# EAGLE design power-supply (EAGLE 9.6.2)
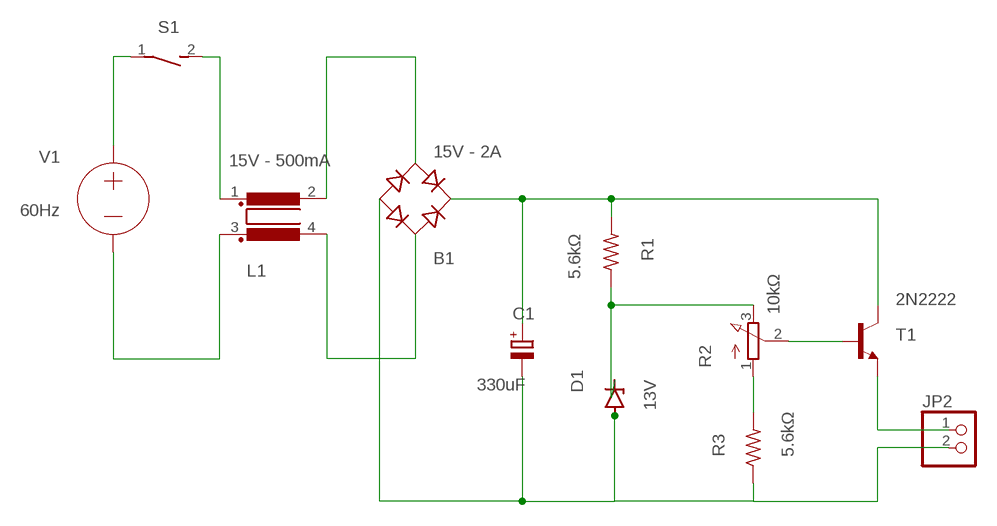
[diagram p0: schematic, sheet 1]

## Parts
B1  15V - 2A  RB1A  [RB1A]
C1  330uF  CPOL-EUE3.5-10  [E3,5-10]
D1  13V  ZENER-DIODEDO41Z10  [DO41Z10]
JP2  PINHD-1X2  [1X02]
L1  15V - 500mA  R1405VB2  [B2]
R1  5.6kΩ  R-US_0309/12  [0309/12]
R2  10kΩ  3RP/1610N  [3RP/1610N]
R3  5.6kΩ  R-US_0309/12  [0309/12]
S1  DS01E  [DS-01]
T1  2N2222  [TO18]
V1  60Hz  VOLTAGE  (no package)

## Nets
N$1: R2.1(A) R3.2
N$2: S1.1 V1.+
N$4: B1.AC2 L1.2
N$5: B1.AC1 L1.4
N$6: D1.C R1.1 R2.3(E)
N$7: B1.+ C1.+ R1.2 T1.3(C)
N$8: B1.- C1.- D1.A JP2.2 R3.1
N$9: JP2.1 T1.1(E)
N$11: L1.1 S1.2
N$12: R2.2(S) T1.2(B)
N$13: L1.3 V1.-

## Library data of the parts
B1 = rectifier:RB1A: RECTIFIER 1 A
C1 = rcl:CPOL-EU: POLARIZED CAPACITOR, European symbol; SPICEPREFIX: C
D1 = diode:ZENER-DIODE: Z-Diode
JP2 = pinhead:PINHD-1X2: PIN HEADER
L1 = inductor-nkl:R1405V: Übertrager (verlustarm) bis typ. 400kHz Power transformer (low loss) up to typ. 400kHz; OC_FARNELL: unknown; OC_NEWARK: unknown
R1 R3 = rcl:R-US_: RESISTOR, American symbol; SPICEPREFIX: R
R2 = pot:3RP/1610N: 16mm Potentiometer one level Source: http://www.alphapotentiometers.net/html/16mm_pot_2.html
S1 = switch-dil:DS01E: DIL/CODE SWITCH; OC_FARNELL: unknown; OC_NEWARK: unknown
T1 = transistor-neu-to92:2N2222: NPN TRANSISTOR
V1 = ngspice-simulation:VOLTAGE: Independent Voltage Source, either DC, AC, PULSE, SINE, PWL, EXP, or SFFM; VALUE: 0V

## Board
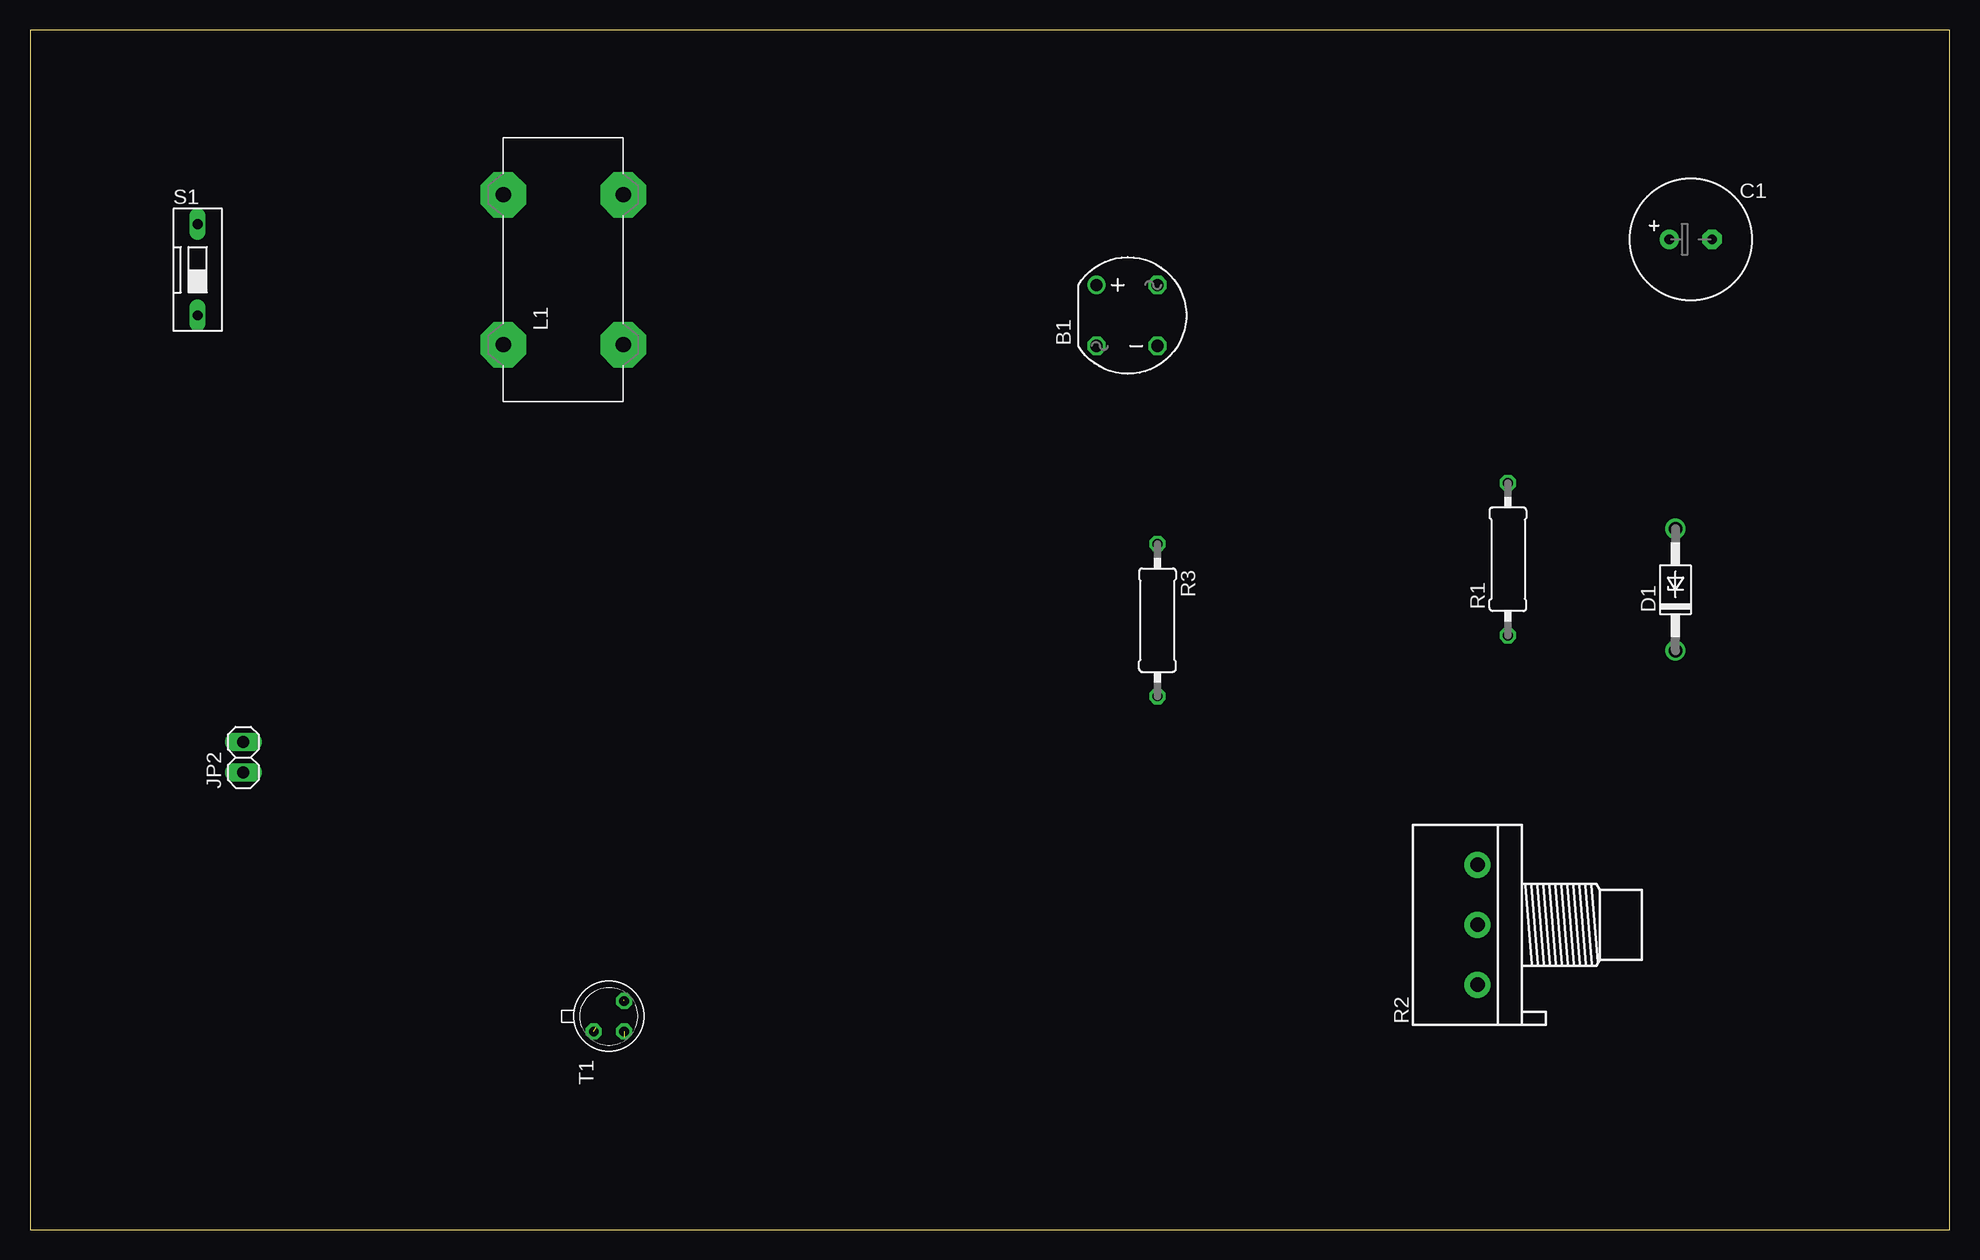
[diagram p1: board, top side]
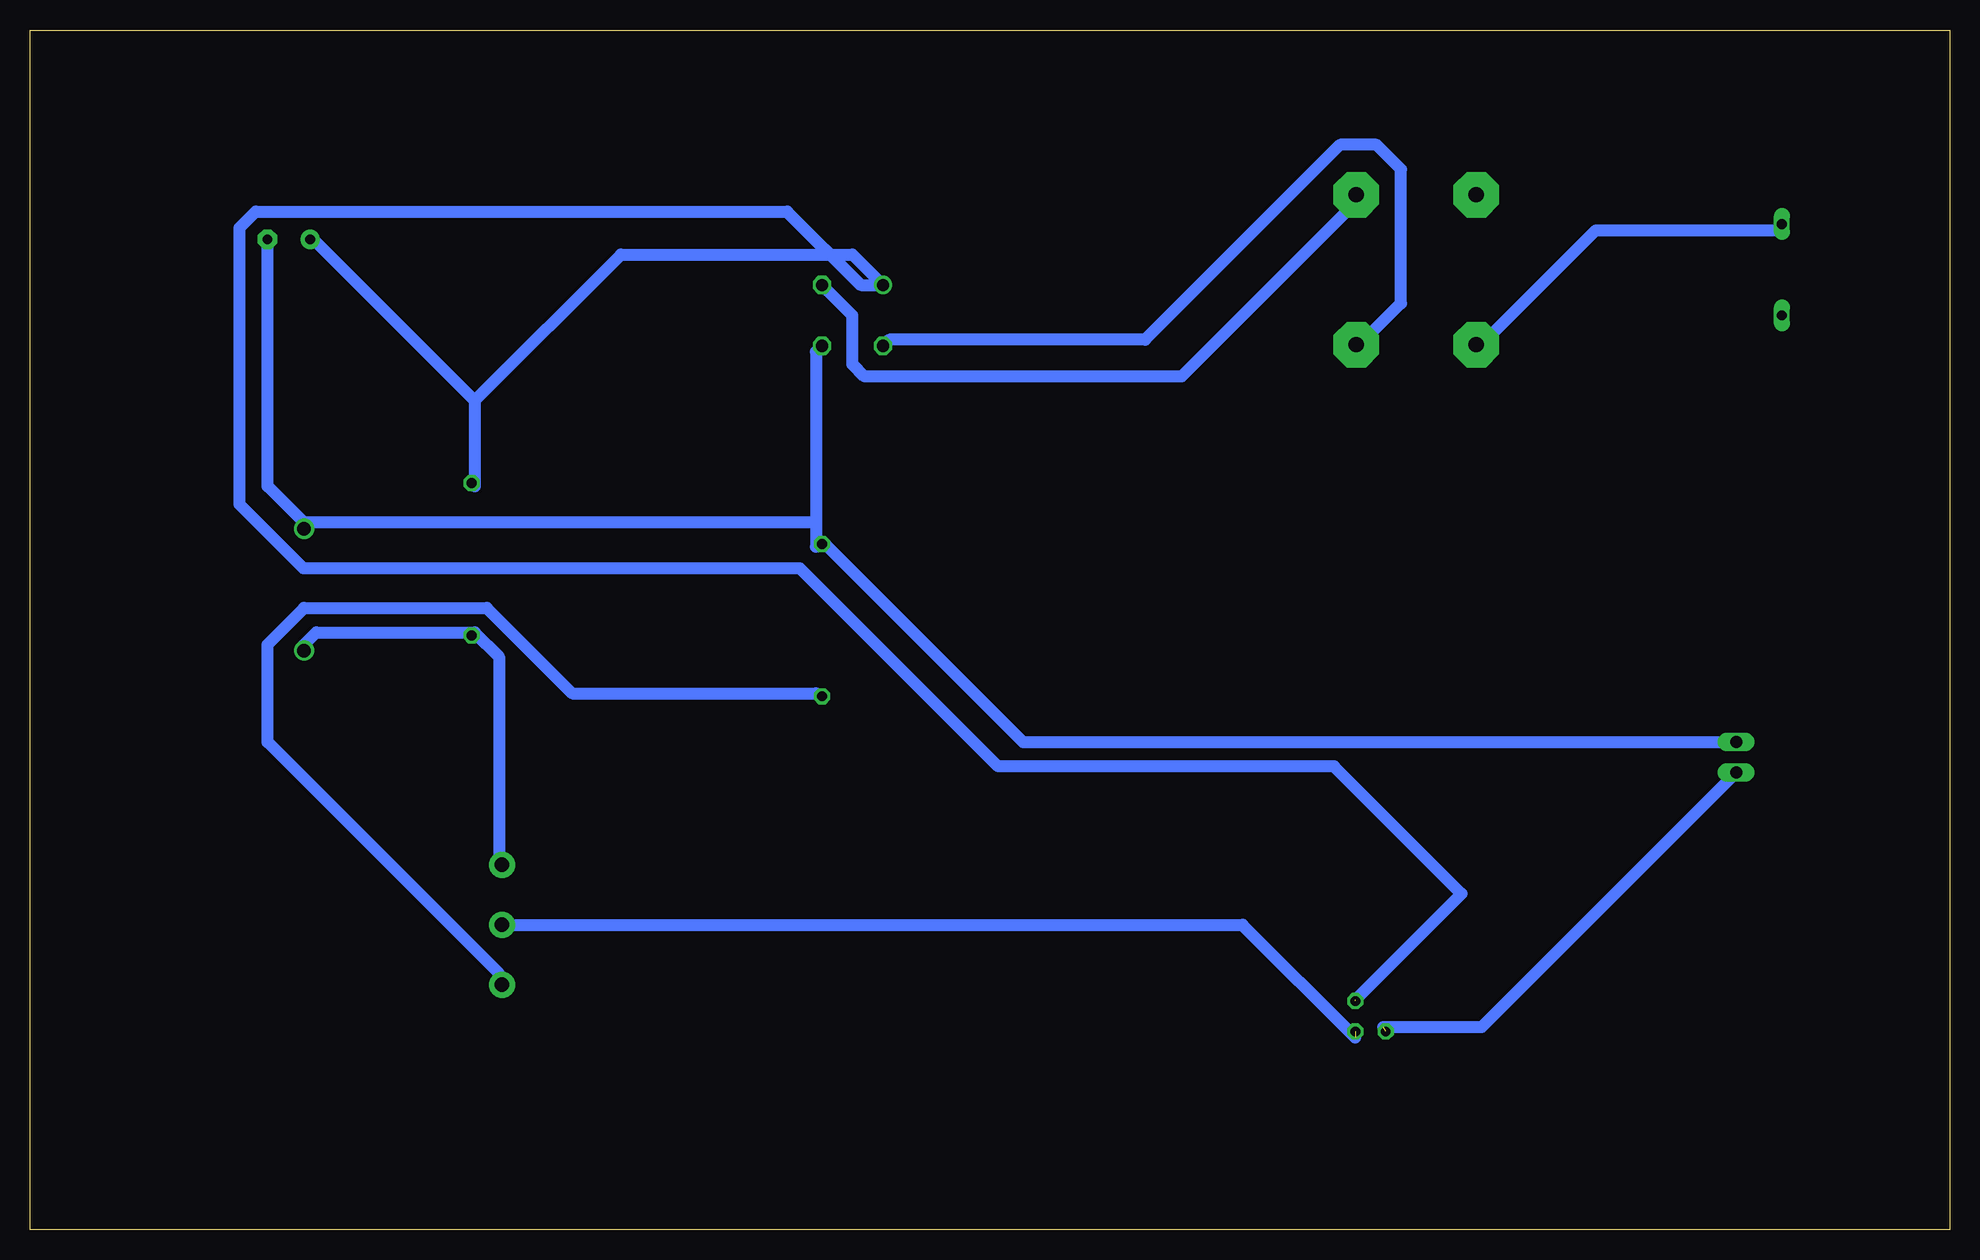
[diagram p2: board, bottom side, seen from below]

Size 160 x 100 mm. Coordinates in mm from the lower left corner, seen from the top.
Outline: 0,0 160,0 160,100 0,100 0,0
Copper layers (1*16): Top 0.035mm / dielectric 1.5mm / Bottom 0.035mm
Design rules "default *": minimum track width 40mil, minimum drill 0.35mm, track to track 40mil, track to pad 40mil, pad to pad 40mil, via to via 40mil, smd to smd 6mil, copper to edge 40mil, drill to drill 6mil, minimum pad ring 10mil, minimum via ring 8mil, stop-mask expansion 4mil, vias tented up to drill 0mil, thermal gap 10mil

### Footprints (pad centres in the part's own frame; a part is rotated, then mirrored left to right if it is on the bottom)
RB1A = drill 1.016: + -2.54,2.54 | drill 1.016 octagon: - 2.54,-2.54; AC1 2.54,2.54; AC2 -2.54,-2.54
E3,5-10 = drill 0.813 pad 1.6: + -1.778,0 | drill 0.813 pad 1.6 octagon: - 1.778,0
DO41Z10 = drill 1.118: A 5.08,0; C -5.08,0
1X02 = drill 1.016 long: 1 -1.27,0; 2 1.27,0
B2 = drill 1.27 pad 3.81 octagon: 1 -6.25,5; 2 -6.25,-5; 3 6.25,5; 4 6.25,-5
0309/12 = drill 0.813 octagon: 1 -6.35,0; 2 6.35,0
3RP/1610N = drill 1.2 pad 2.184: 1 -5,0; 2 0,0; 3 5,0
DS-01 = drill 0.813 long: 1 0,-3.81; 2 0,3.81
TO18 = drill 0.813 octagon: 1 -1.27,-1.27; 2 1.27,-1.27; 3 1.27,1.27

### Placement (x,y rotation side)
B1  91.44,76.2 0 top
C1  138.43,82.55 0 top
D1  137.16,53.34 90 top
JP2  17.78,39.37 90 top
L1  44.45,80.01 90 top
R1  123.19,55.88 90 top
R2  120.65,25.4 90 top
R3  93.98,50.8 270 top
S1  13.97,80.01 0 top
T1  48.26,17.78 0 top

### Tracks (layer width: path | path; a pad name or v marks a point on that pad's centre or on a via)
N$1
  Bottom 1.016: R3.2 94.49,44.7 114.81,44.7 121.92,51.82 137.16,51.82 140.21,48.77 140.21,40.64 120.9,21.34 R2.1
N$4
  Bottom 1.016: B1.AC2 88.39,74.17 67.06,74.17 50.8,90.42 47.75,90.42 45.72,88.39 45.72,77.22 48.77,74.17 L1.2
N$5
  Bottom 1.016: B1.AC1 91.44,76.2 91.44,72.14 90.42,71.12 64.01,71.12 49.78,85.34 L1.4
N$6
  Bottom 0.152: R2.3 120.65,31.65 | 137.16,48.16 D1.C
  Bottom 1.016: 122.94,49.78 136.14,49.78 137.16,48.77 D1.C | 122.94,49.78 120.9,47.75 120.9,30.48 R2.3 | 122.94,49.78 R1.1
N$7  (1 unrouted)
  Bottom 1.016: 122.94,69.09 122.94,61.98 R1.2 | 122.94,69.09 136.14,82.3 C1.+ | 122.94,69.09 110.74,81.28 91.44,81.28 B1.+ 90.75,78.74 96.88,84.87 141.17,84.87 142.53,83.51 142.53,60.45 137.2,55.12 95.81,55.12 79.3,38.61 51.31,38.61 40.68,27.98 49.53,19.14
N$8
  Bottom 1.016: C1.- 140.21,61.98 137.16,58.93 | 94.49,58.93 94.49,73.15 B1.- | 94.49,58.93 94.49,56.9 R3.1 93.73,57.15 77.22,40.64 JP2.2 | 94.49,58.93 137.16,58.93 | 137.16,58.93 D1.A
N$9  (1 unrouted)
  Bottom 1.016: 47.19,16.87 39.01,16.87 JP2.1
N$11
  Bottom 1.016: S1.2 14.22,83.31 29.46,83.31 38.61,74.17 L1.1
N$12  (1 unrouted)
  Bottom 1.016: 49.53,16 58.93,25.4 R2.2